# EAGLE design Sheamtic (EAGLE 9.5.2)
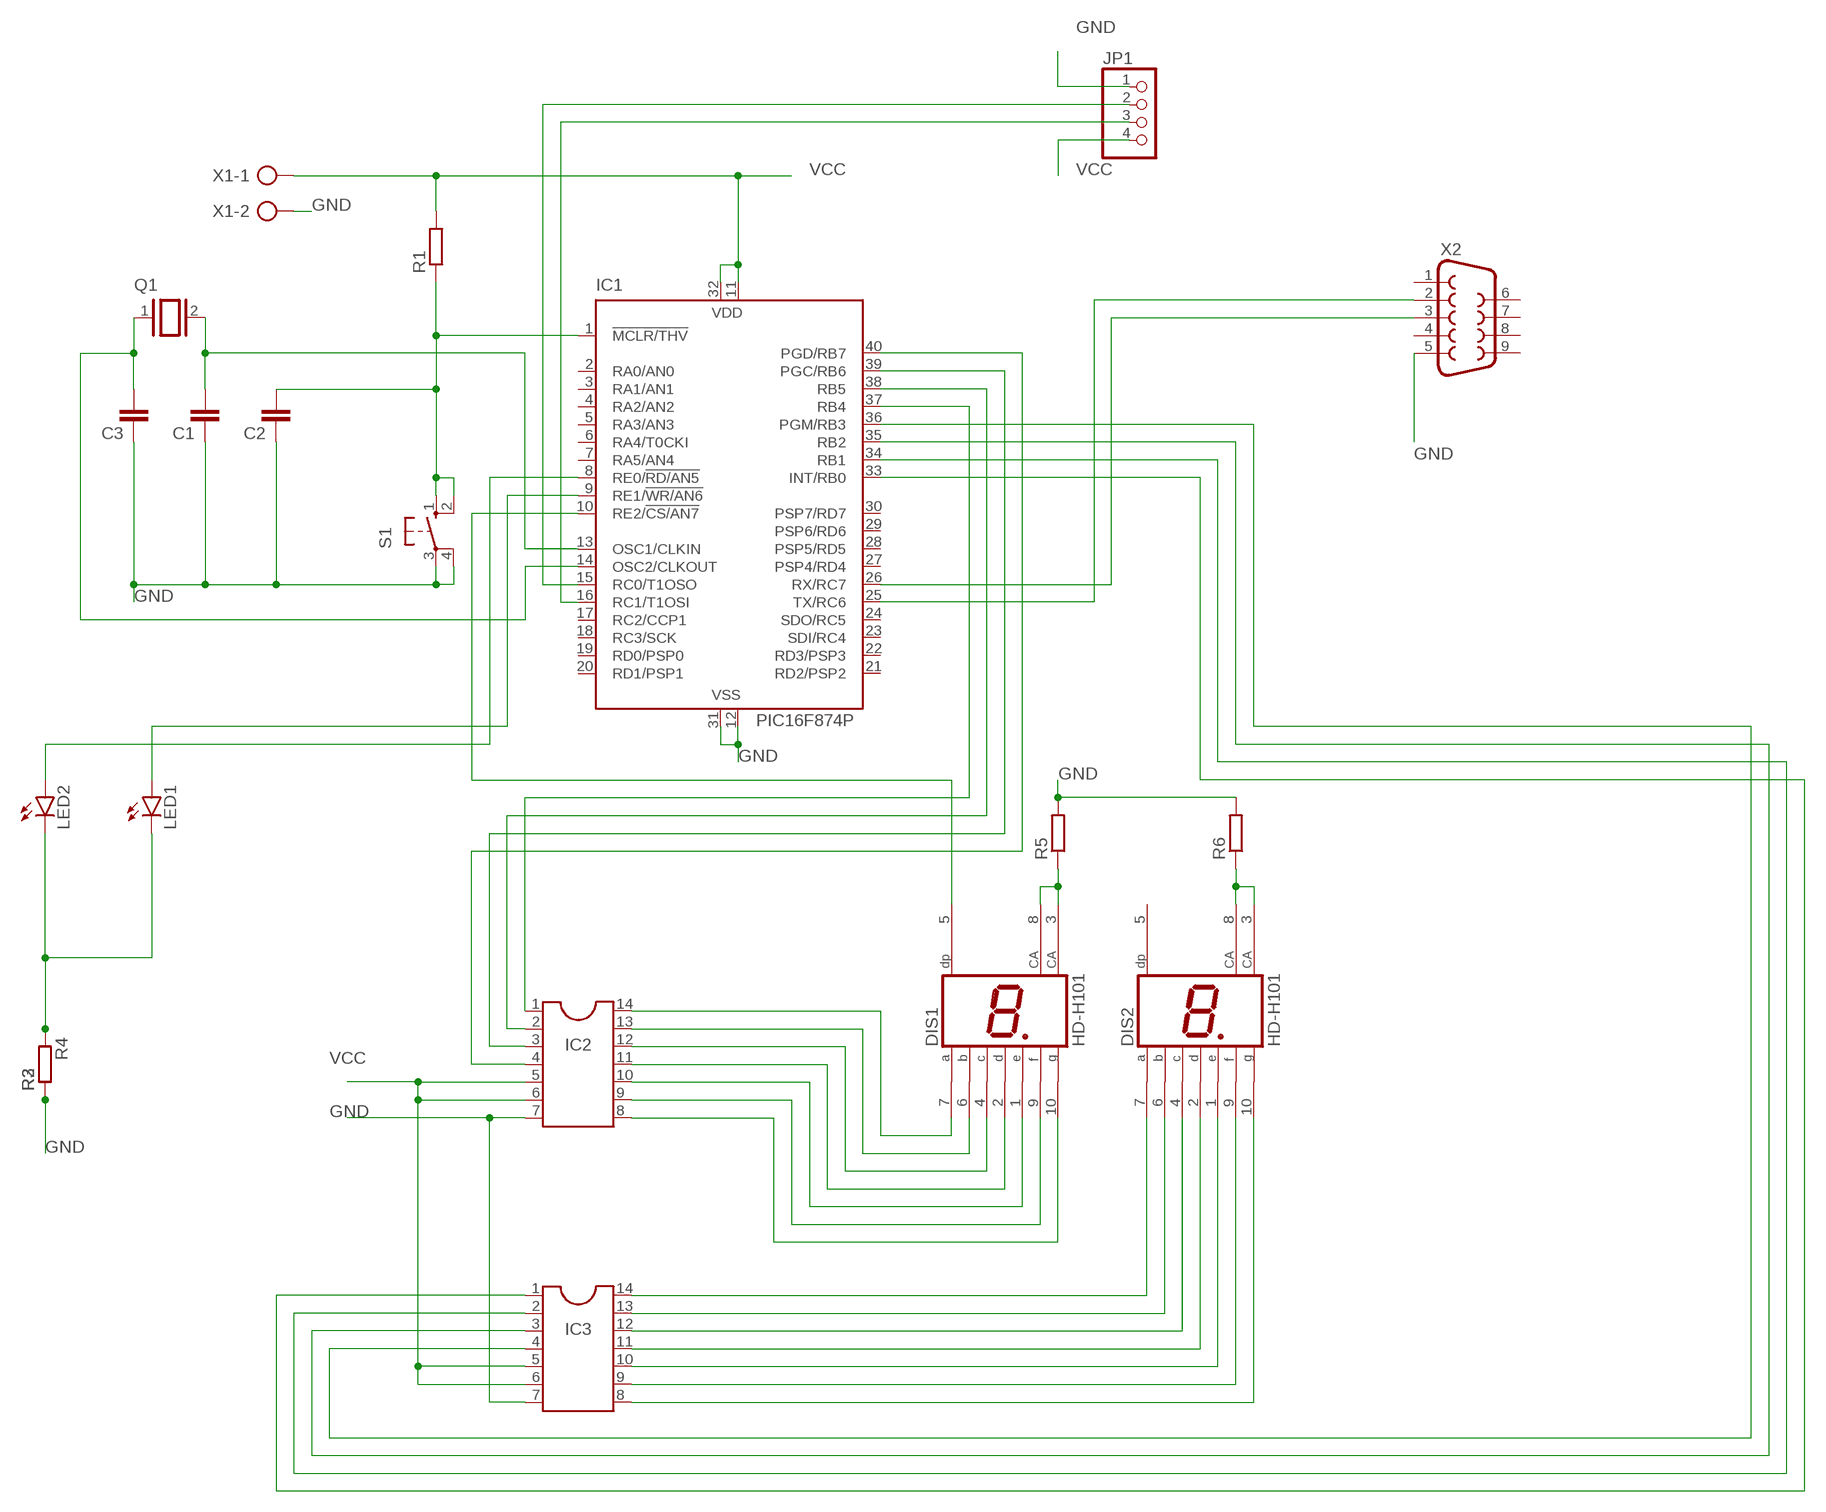
[diagram p0: schematic, sheet 1]

## Parts
C1  C-EU025-025X050  [C025-025X050]
C2  C-EU025-025X050  [C025-025X050]
C3  C-EU025-025X050  [C025-025X050]
DIS1  HD-H101  [HDSP-M]
DIS2  HD-H101  [HDSP-M]
IC1  PIC16F874P  [DIL40]
IC2  DIL14  [DIL14]
IC3  DIL14  [DIL14]
JP1  PINHD-1X4  [1X04]
LED1  LED5MM  [LED5MM]
LED2  LED5MM  [LED5MM]
Q1  XTAL/S  [QS]
R1  R-EU_0204/7  [0204/7]
R2  R-EU_0204/7  [0204/7]
R3  R-EU_0204/7  [0204/7]
R4  R-EU_0204/7  [0204/7]
R5  R-EU_0204/7  [0204/7]
R6  R-EU_0204/7  [0204/7]
S1  10-XX  [B3F-10XX]
X1  AK300/2  [AK300/2]
X2  F09HP  [F09HP]

## Nets
GND: C1.1 C2.1 C3.1 DIS1.3(CA) DIS1.8(CA) IC1.12(VSS) IC1.31(VSS) IC2.7 IC3.7 JP1.1 R2.1 R3.1 R4.2 R5.1 R5.2 R6.2 S1.3(P) S1.4(P1) X1.2 X2.5
N$1: DIS1.7(A) IC2.14
N$2: C2.2 IC1.1(!MCLR/THV) R1.1 S1.1(S) S1.2(S1)
N$3: IC1.15(RC0/T1OSO) JP1.2
N$4: IC1.37(RB4) IC2.1
N$5: C3.2 IC1.14(OSC2/CLKOUT) Q1.1
N$6: IC1.25(TX/RC6) X2.2
N$7: IC1.26(RX/RC7) X2.3
N$8: IC1.38(RB5) IC2.2
N$9: C1.2 IC1.13(OSC1/CLKIN) Q1.2
N$10: IC1.39(PGC/RB6) IC2.3
N$11: IC1.33(INT/RB0) IC3.1
N$13: IC1.34(RB1) IC3.2
N$14: IC1.35(RB2) IC3.3
N$15: IC1.36(PGM/RB3) IC3.4
N$16: IC1.8(RE0/!RD/AN5) LED2.A
N$17: IC1.9(RE1/!WR/AN6) LED1.A
N$18: LED1.K(C) LED2.K(C) R2.2 R3.2 R4.1
N$19: DIS1.6(B) IC2.13
N$20: DIS1.4(C) IC2.12
N$21: DIS1.2(D) IC2.11
N$22: DIS1.1(E) IC2.10
N$23: DIS1.9(F) IC2.9
N$24: DIS1.10(G) IC2.8
N$25: DIS2.7(A) IC3.14
N$26: DIS2.6(B) IC3.13
N$27: DIS2.4(C) IC3.12
N$28: DIS2.2(D) IC3.11
N$29: DIS2.1(E) IC3.10
N$30: DIS2.9(F) IC3.9
N$31: DIS2.10(G) IC3.8
N$32: IC1.16(RC1/T1OSI) JP1.3
N$33: IC1.40(PGD/RB7) IC2.4
N$34: DIS1.5(DP) IC1.10(RE2/!CS/AN7)
N$35: DIS2.3(CA) DIS2.8(CA) R6.1
VCC: IC1.11(VDD) IC1.32(VDD) IC2.5 IC2.6 IC3.5 IC3.6 JP1.4 R1.2 X1.1
Unconnected: DIS2.5(DP) IC1.2(RA0/AN0) IC1.3(RA1/AN1) IC1.4(RA2/AN2) IC1.5(RA3/AN3) IC1.6(RA4/T0CKI) IC1.7(RA5/AN4) IC1.17(RC2/CCP1) IC1.18(RC3/SCK) IC1.19(RD0/PSP0) IC1.20(RD1/PSP1) IC1.21(RD2/PSP2) IC1.22(RD3/PSP3) IC1.23(SDI/RC4) IC1.24(SDO/RC5) IC1.27(PSP4/RD4) IC1.28(PSP5/RD5) IC1.29(PSP6/RD6) IC1.30(PSP7/RD7) X2.1 X2.4 X2.6 X2.7 X2.8 X2.9

## Library data of the parts
C1-C3 = rcl:C-EU: CAPACITOR, European symbol; SPICEPREFIX: C
DIS1 DIS2 = display-hp:HD-H101: LED DISPLAY 1-character 7 segment, decimal point right; OC_FARNELL: unknown; OC_NEWARK: unknown
IC1 = microchip:PIC16F87*: MICROCONTROLLER; MPN: PIC16F874-04I/P; OC_FARNELL: 1196797; OC_NEWARK: 24M5903
IC2 IC3 = ic-package:DIL14: Dual In Line / Socket
JP1 = pinhead:PINHD-1X4: PIN HEADER
LED1 LED2 = led:LED: LED OSRAM: - CHIPLED LG R971, LG N971, LY N971, LG Q971, LY Q971, LO R971, LY R971 LH N974, LH R974 LS Q976, LO Q976, LY Q976 LO Q996 - Hyper CHIPLED LW Q18S LB Q993, LB Q99A, LB R99A - SideLED LS A670, LO A670, LY A670, LG A670, LP A670 LB A673, LV A673, LT A673, LW A673 LH A674 LY A675 LS A676, LA A676, LO A676, LY A676, LW A676 LS A679, LY A679, LG A679 - Hyper Micro SIDELED® LS Y876, LA Y876, LO Y876, LY Y876 LT Y87S - SmartLED LW L88C, LW L88S LB L89C, LB L89S, LG L890 LS L89K, LO L89K, LY L89K LS L896, LA L896, LO L896, LY L896 - TOPLED LS T670, LO T670, LY T670, LG T670, LP T670 LSG T670, LSP T670, LSY T670, LOP T670, LYG T670 LG T671, LOG T671, LSG T671 LB T673, LV T673, LT T673, LW T673 LH T674 LS T676, LA T676, LO T676, LY T676, LB T676, LH T676, LSB T676, LW T676 LB T67C, LV T67C, LT T67C, LS T67K, LO T67K, LY T67K, LW E67C LS E67B, LA E67B, LO E67B, LY E67B, LB E67C, LV E67C, LT E67C LW T67C LS T679, LY T679, LG T679 LS T770, LO T770, LY T770, LG T770, LP T770 LB T773, LV T773, LT T773, LW T773 LH T774 LS E675, LA E675, LY E675, LS T675 LS T776, LA T776, LO T776, LY T776, LB T776 LHGB T686 LT T68C, LB T68C - Hyper Mini TOPLED® LB M676 - Mini TOPLED Santana® LG M470 LS M47K, LO M47K, LY M47K Source: http://www.osram.convergy.de LUXEON: - LUMILED® LXK2-PW12-R00, LXK2-PW12-S00, LXK2-PW14-U00, LXK2-PW14-V00 LXK2-PM12-R00, LXK2-PM12-S00, LXK2-PM14-U00 LXK2-PE12-Q00, LXK2-PE12-R00, LXK2-PE12-S00, LXK2-PE14-T00, LXK2-PE14-U00 LXK2-PB12-K00, LXK2-PB12-L00, LXK2-PB12-M00, LXK2-PB14-N00, LXK2-PB14-P00, LXK2-PB14-Q00 LXK2-PR12-L00, LXK2-PR12-M00, LXK2-PR14-Q00, LXK2-PR14-R00 LXK2-PD12-Q00, LXK2-PD12-R00, LXK2-PD12-S00 LXK2-PH12-R00, LXK2-PH12-S00 LXK2-PL12-P00, LXK2-PL12-Q00, LXK2-PL12-R00 Source: www.luxeon.com KINGBRIGHT: KA-3528ASYC Source: www.kingbright.com
Q1 = special:XTAL/S: CRYSTAL
R1-R6 = rcl:R-EU_: RESISTOR, European symbol; SPICEPREFIX: R
S1 = switch-omron:10-XX: OMRON SWITCH; MPN: B3F-1000; OC_FARNELL: 176432; OC_NEWARK: 36M3542
X1 = con-ptr500:AK300/2: CONNECTOR; OC_FARNELL: unknown; OC_NEWARK: unknown
X2 = con-subd:F09: SUB-D; OC_FARNELL: unknown; OC_NEWARK: unknown

## Board
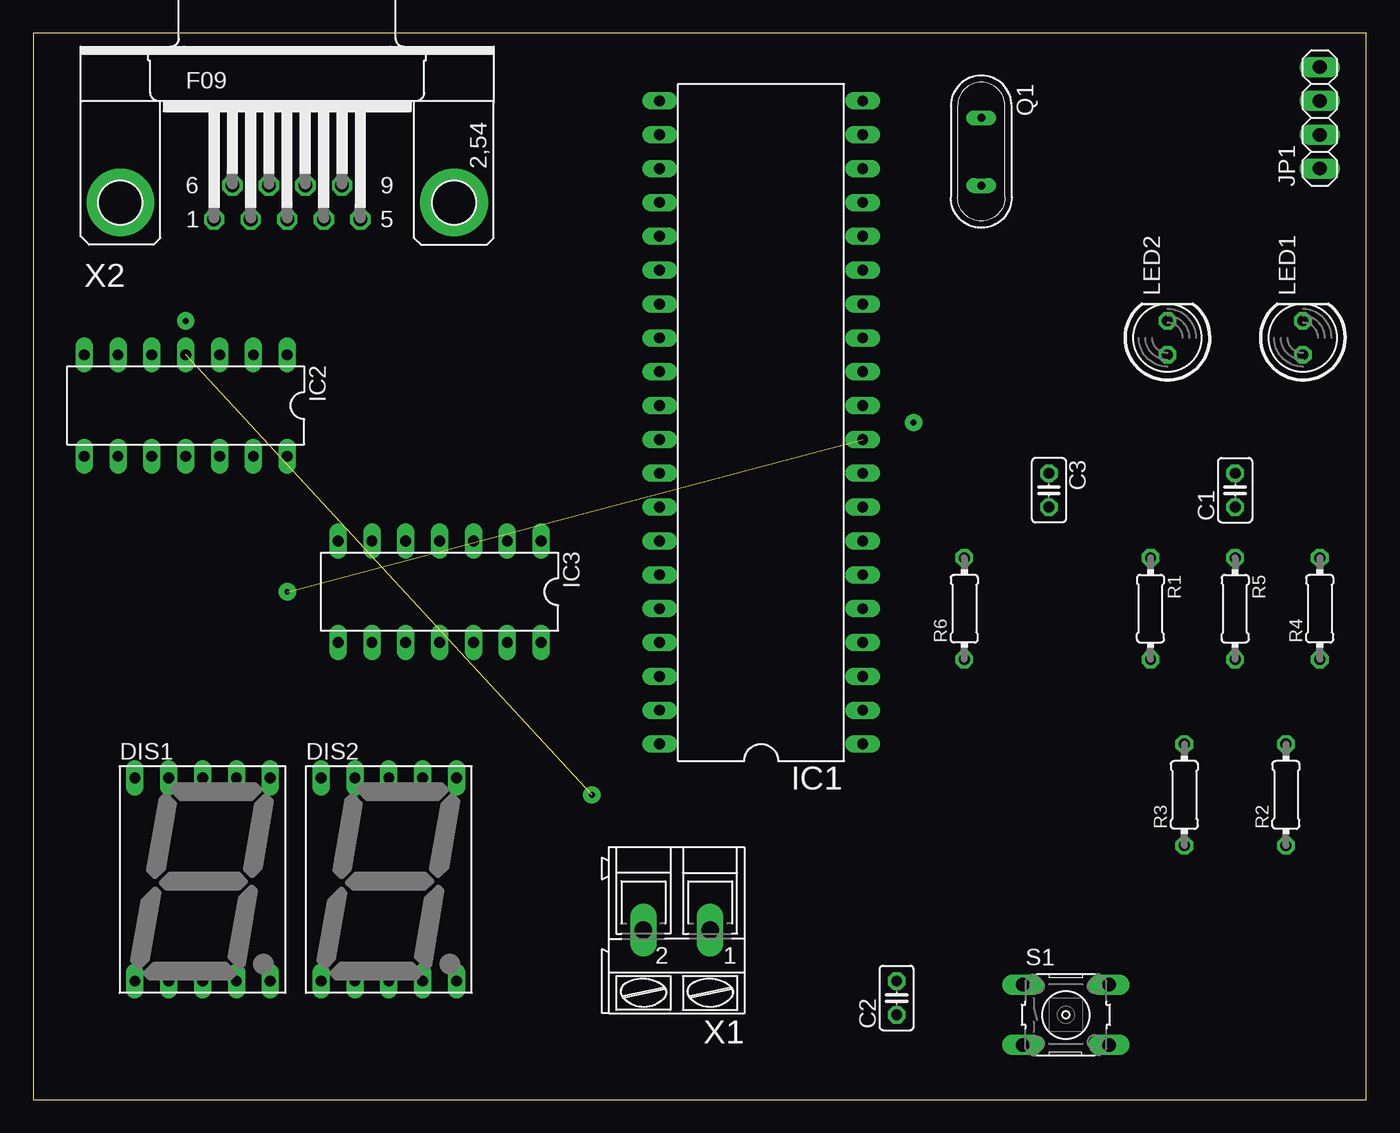
[diagram p1: board, top side]
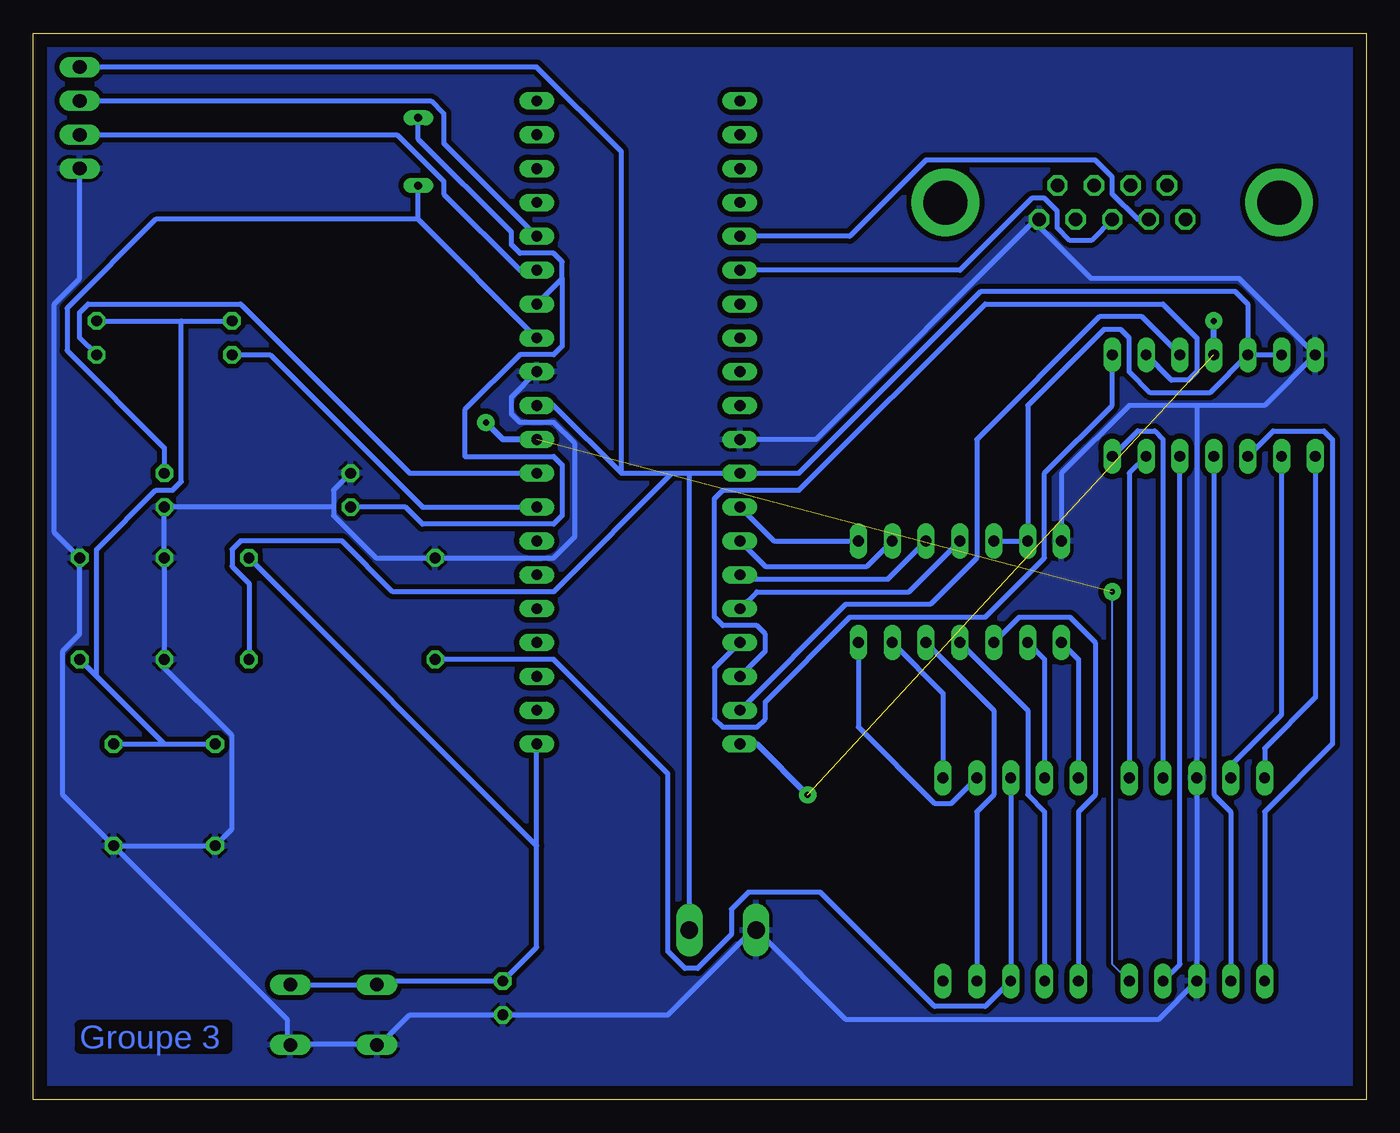
[diagram p2: board, bottom side, seen from below]

Size 100 x 80 mm. Coordinates in mm from the lower left corner, seen from the top.
Outline: 0,0 100,0 100,80 0,80 0,0
Copper layers (1*16): Top 0.035mm / dielectric 1.5mm / Bottom 0.035mm
Design rules "default *": minimum track width 15mil, minimum drill 0.35mm, track to track 15mil, track to pad 15mil, pad to pad 15mil, via to via 15mil, smd to smd 15mil, copper to edge 40mil, drill to drill 6mil, minimum pad ring 10mil, minimum via ring 8mil, stop-mask expansion 4mil, vias tented up to drill 0mil, thermal gap 10mil

### Footprints (pad centres in the part's own frame; a part is rotated, then mirrored left to right if it is on the bottom)
C025-025X050 = drill 0.813 octagon: 1 -1.27,0; 2 1.27,0
HDSP-M = drill 0.813 long: 1 -5.08,-7.62; 2 -2.54,-7.62; 3 0,-7.62; 4 2.54,-7.62; 5 5.08,-7.62; 6 5.08,7.62; 7 2.54,7.62; 8 0,7.62; 9 -2.54,7.62; 10 -5.08,7.62
DIL40 = drill 0.813 long: 1 -24.13,-7.62; 2 -21.59,-7.62; 3 -19.05,-7.62; 4 -16.51,-7.62; 5 -13.97,-7.62; 6 -11.43,-7.62; 7 -8.89,-7.62; 8 -6.35,-7.62; 9 -3.81,-7.62; 10 -1.27,-7.62; 11 1.27,-7.62; 12 3.81,-7.62; 13 6.35,-7.62; 14 8.89,-7.62; 15 11.43,-7.62; 16 13.97,-7.62; 17 16.51,-7.62; 18 19.05,-7.62; 19 21.59,-7.62; 20 24.13,-7.62; 21 24.13,7.62; 22 21.59,7.62; 23 19.05,7.62; 24 16.51,7.62; 25 13.97,7.62; 26 11.43,7.62; 27 8.89,7.62; 28 6.35,7.62; 29 3.81,7.62; 30 1.27,7.62; 31 -1.27,7.62; 32 -3.81,7.62; 33 -6.35,7.62; 34 -8.89,7.62; 35 -11.43,7.62; 36 -13.97,7.62; 37 -16.51,7.62; 38 -19.05,7.62; 39 -21.59,7.62; 40 -24.13,7.62
DIL14 = drill 0.813 long: 1 -7.62,-3.81; 2 -5.08,-3.81; 3 -2.54,-3.81; 4 0,-3.81; 5 2.54,-3.81; 6 5.08,-3.81; 7 7.62,-3.81; 8 7.62,3.81; 9 5.08,3.81; 10 2.54,3.81; 11 0,3.81; 12 -2.54,3.81; 13 -5.08,3.81; 14 -7.62,3.81
1X04 = drill 1.016 long: 1 -3.81,0; 2 -1.27,0; 3 1.27,0; 4 3.81,0
LED5MM = drill 0.813 octagon: A -1.27,0; K 1.27,0
QS = drill 0.61 long: 1 -2.54,0; 2 2.54,0
0204/7 = drill 0.813 octagon: 1 -3.81,0; 2 3.81,0
B3F-10XX = drill 1.016 long: 1 -3.251,2.261; 2 3.251,2.261; 3 -3.251,-2.261; 4 3.251,-2.261
AK300/2 = drill 1.321 long: 1 -2.515,0; 2 2.489,0
F09HP = drill 1.016 octagon: 1 -5.486,-1.27; 2 -2.743,-1.27; 3 0,-1.27; 4 2.743,-1.27; 5 5.486,-1.27; 6 -4.115,1.27; 7 -1.372,1.27; 8 1.372,1.27; 9 4.115,1.27 | drill 3.302 pad 5.08: G1 -12.522,0; G2 12.522,0

### Placement (x,y rotation side)
C1  90.17,45.72 90 top
C2  64.77,7.62 90 top
C3  76.2,45.72 270 top
DIS1  12.7,16.51 0 top
DIS2  26.67,16.51 0 top
IC1  54.61,50.8 90 top
IC2  11.43,52.07 180 top
IC3  30.48,38.1 180 top
JP1  96.52,73.66 90 top
LED1  95.25,57.15 90 top
LED2  85.09,57.15 90 top
Q1  71.12,71.12 270 top
R1  83.82,36.83 270 top
R2  93.98,22.86 90 top
R3  86.36,22.86 90 top
R4  96.52,36.83 90 top
R5  90.17,36.83 270 top
R6  69.85,36.83 90 top
S1  77.47,6.35 0 top
X1  48.26,12.7 180 top
X2  19.05,67.31 0 top

### Tracks (layer width: path | path; a pad name or v marks a point on that pad's centre or on a via)
GND
  Bottom 0.381: IC1.31 41.27,49.53 24.77,66.04 X2.5 24.45,66.04 24.45,65.41 20.64,61.59 9.53,61.59 IC2.7 7.62,52.07 12.7,52.07 | IC3.7 22.86,46.99 17.78,52.07 12.7,52.07 | 12.7,52.07 DIS1.8 DIS1.3 15.56,6.03 39.05,6.03 45.72,12.7 X1.2 46.04,12.7 52.39,6.35 C2.1 71.75,6.35 73.98,4.13 S1.3 74.3,4.13 80.64,4.13 S1.4 80.96,4.13 80.96,6.03 R2.1 | 77.47,44.45 77.47,45.72 C3.1 | 77.47,44.45 77.47,43.81 74.3,40.64 R6.2 60.96,40.64 59.37,42.23 59.37,49.21 60.96,50.8 63.5,50.8 64.14,51.44 64.14,52.7 IC1.12 | 77.47,44.45 C1.1 R5.1 R5.2 90.17,32.38 85.09,27.3 85.09,20.32 R3.1 R2.1 | R2.1 97.79,22.86 97.79,33.66 96.52,34.92 R4.2 98.42,42.55 98.42,59.69 96.52,61.59 JP1.1
  pour Bottom (isolate 0.02): 0,80.01 99.06,80.01 99.06,0 0,0
N$1
  Bottom 0.381: DIS1.7 15.24,49.53 15.88,50.16 17.14,50.16 IC2.14
N$2
  Bottom 0.381: 62.23,19.05 62.23,11.43 C2.2 73.98,8.89 S1.1 74.3,8.57 80.64,8.57 S1.2 | 62.23,19.05 IC1.1 | 62.23,19.05 R1.1
N$3
  Bottom 0.381: IC1.15 63.5,62.23 69.22,67.94 69.22,68.9 72.71,72.39 JP1.2
N$4
  Bottom 0.381: IC2.1 19.05,52.07 24.13,46.99 24.13,40.64 28.57,36.2 38.73,36.2 45.09,29.84 45.09,28.57 45.72,27.94 48.26,27.94 48.9,28.57 48.9,32.38 IC1.37
N$5
  Bottom 0.381: Q1.1 71.12,72.07 64.14,65.09 64.14,64.14 63.5,63.5 60.96,63.5 60.33,62.87 60.33,61.59 | IC1.14 60.33,61.59 | C3.2 72.07,44.45 70.8,43.18 60.96,43.18 60.33,43.81 60.33,47.62 60.96,48.26 67.63,48.26 67.63,51.75 63.5,55.88 60.96,55.88 60.33,56.52 60.33,61.59
N$6
  Bottom 0.381: IC1.25 38.73,64.77 33.02,70.48 20.32,70.48 19.05,69.22 19.05,67.94 17.14,66.04 X2.2
N$7
  Bottom 0.381: IC1.26 30.48,62.23 25.08,67.63 24.13,67.63 23.18,66.67 23.18,65.41 22.23,64.45 20.64,64.45 X2.3
N$8
  Bottom 0.381: IC2.2 14.61,53.98 13.34,53.98 12.7,54.61 12.7,57.15 15.24,59.69 28.57,59.69 42.55,45.72 48.26,45.72 48.9,45.09 48.9,36.2 48.26,35.56 45.72,35.56 45.09,34.92 45.09,33.66 IC1.38
N$9
  Bottom 0.381: 71.12,66.04 Q1.2 | IC1.13 71.12,66.04 | C1.2 90.17,48.9 97.47,56.2 97.47,59.37 90.81,66.04 71.12,66.04
N$10
  Bottom 0.381: IC1.39 39.05,37.15 32.7,37.15 29.21,40.64 29.21,49.53 20,58.74 16.83,58.74 IC2.3
N$11
  Bottom 0.381: IC3.1 44.45,41.91 IC1.33
N$13
  Bottom 0.381: IC3.2 37.47,40.01 45.09,40.01 IC1.34
N$14
  Bottom 0.381: IC3.3 35.88,39.05 46.67,39.05 IC1.35
N$15
  Bottom 0.381: IC3.4 34.29,38.1 45.72,38.1 IC1.36
N$16
  Bottom 0.381: IC1.8 70.8,44.45 82.23,55.88 LED2.A
N$17
  Bottom 0.381: IC1.9 71.75,46.99 84.45,59.69 95.89,59.69 96.52,59.05 96.52,57.15 LED1.A
N$18
  Bottom 0.381: LED1.K 88.9,58.42 | 88.9,58.42 LED2.K | R2.2 90.17,26.67 | 90.17,26.67 R3.2 | 90.17,26.67 95.25,31.75 | 95.25,31.75 R4.1 | 88.9,58.42 88.9,46.35 89.53,45.72 90.81,45.72 95.25,41.27 95.25,31.75
N$19
  Bottom 0.381: DIS1.6 17.78,46.99 IC2.13
N$20
  Bottom 0.381: IC2.12 13.97,10.16 DIS1.4
N$21
  Bottom 0.381: DIS1.2 10.16,21.59 11.43,22.86 IC2.11
N$22
  Bottom 0.381: DIS1.1 7.62,21.59 2.54,26.67 2.54,49.53 3.17,50.16 6.99,50.16 IC2.10
N$23
  Bottom 0.381: IC2.9 6.35,28.89 10.16,25.08 DIS1.9
N$24
  Bottom 0.381: DIS1.10 7.62,26.35 3.81,30.16 IC2.8
N$25
  Bottom 0.381: DIS2.7 31.11,22.23 32.38,22.23 38.1,27.94 IC3.14
N$26
  Bottom 0.381: DIS2.6 31.75,30.48 IC3.13
N$27
  Bottom 0.381: DIS2.4 29.21,21.59 27.94,22.86 27.94,29.21 IC3.12
N$28
  Bottom 0.381: DIS2.2 24.13,21.59 25.4,22.86 25.4,29.21 IC3.11
N$29
  Bottom 0.381: DIS2.1 21.59,21.59 20.32,22.86 20.32,34.29 22.23,36.2 26.04,36.2 IC3.10
N$30
  Bottom 0.381: DIS2.9 24.13,33.02 IC3.9
N$31
  Bottom 0.381: DIS2.10 21.59,33.02 IC3.8
N$32
  Bottom 0.381: IC1.16 69.22,71.75 69.22,73.98 70.17,74.93 JP1.3
N$33  (via drill 0.46 pad 1.3)  (1 unrouted)
  Bottom 0.457: v41.91,22.86 45.72,26.67 IC1.40 | IC2.4 v11.43,58.42
N$34  (via drill 0.38 pad 1.3, 0.46 pad 1.3)  (1 unrouted)
  Bottom 0.152: DIS1.5 19.05,10.16 v19.05,38.1
  Bottom 0.457: IC1.10 64.77,49.53 v66.04,50.8
N$35
  Bottom 0.381: DIS2.8 DIS2.3 28.57,6.99 32.38,6.99 40.96,15.56 46.35,15.56 47.62,14.29 47.62,12.38 50.16,9.84 51.12,9.84 52.39,11.11 52.39,24.45 60.96,33.02 R6.1
VCC
  Bottom 0.381: IC3.5 IC3.6 25.4,52.07 19.68,57.78 18.41,57.78 17.78,57.15 17.78,54.61 16.19,53.02 11.75,53.02 IC2.5 | IC2.5 IC2.6 | 55.88,46.99 52.07,46.99 | 52.07,46.99 50.8,46.99 | 50.8,46.99 IC1.32 42.55,46.99 28.89,60.64 9.84,60.64 8.89,59.69 IC2.5 | 55.88,46.99 60.96,52.07 IC1.11 | R1.2 83.82,38.73 85.09,40.01 85.09,41.27 84.45,41.91 76.83,41.91 73.03,38.1 60.96,38.1 52.07,46.99 | JP1.4 62.23,77.47 55.88,71.12 55.88,46.99 | 50.8,46.99 50.8,12.7 X1.1

### Text on the board
Bottom: Groupe 3